# EAGLE schematic SPI_schematic (EAGLE 8.1.0)
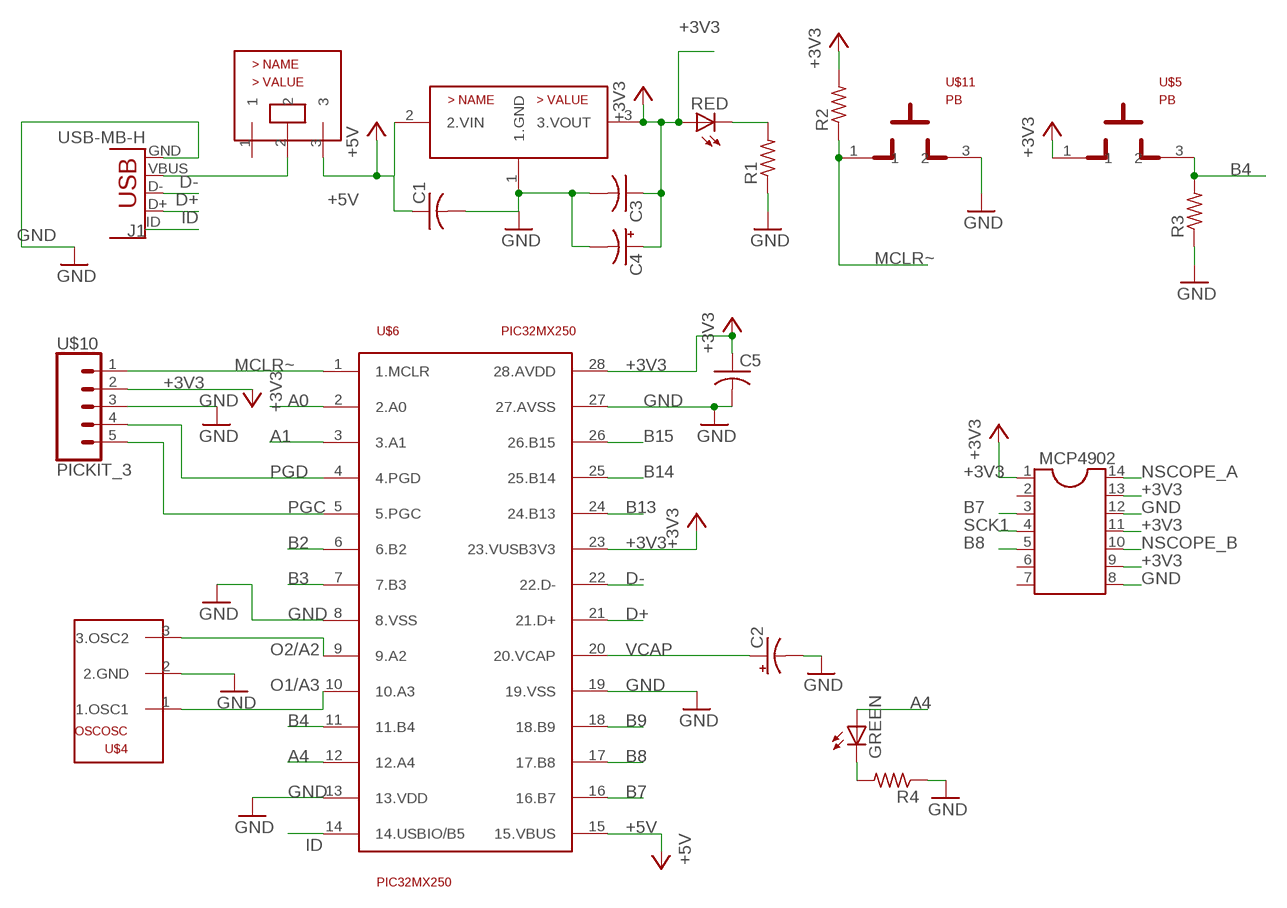
[diagram p0: schematic, sheet 1]

## Parts
_  MCP1702  [TO92]
C1  C-US025-025X050  [C025-025X050]
C2  CPOL-USB45181B  [B45181B]
C3  C-US025-025X050  [C025-025X050]
C4  CPOL-USB45181B  [B45181B]
C5  C-US025-025X050  [C025-025X050]
GREEN  LED3MM  [LED3MM]
J1  USB-MB-H  [USB-MB-H]
MCP4902  DIL14  [DIL14]
R1  R-US_0204/7  [0204/7]
R2  R-US_0204/7  [0204/7]
R3  R-US_0204/7  [0204/7]
R4  R-US_0204/7  [0204/7]
RED  LED3MM  [LED3MM]
U$4  OSCOSC  [OSC]
U$5  PB  [PB]
U$6  PIC32MX250  [DIL28-3]
U$8  SLIDE  [SLIDE]
U$10  PICKIT_3  [1X05]
U$11  PB  [PB]

## Nets
+3V3: _.3(3.VOUT) C3.1 C4.+ C5.1 MCP4902.1 MCP4902.9 MCP4902.11 MCP4902.13 R2.2 RED.A U$5.1 U$6.23(23.VUSB3V3) U$6.28(28.AVDD) U$10.2(2.VDD)
+5V: _.2(2.VIN) C1.1 U$6.15(15.VBUS) U$8.3
A0: U$6.2(2.A0)
A1: U$6.3(3.A1)
A4: GREEN.A U$6.12(12.A4)
B2: U$6.6(6.B2)
B3: U$6.7(7.B3)
B4: R3.2 U$5.3 U$6.11(11.B4)
B7: MCP4902.3 U$6.16(16.B7)
B8: MCP4902.5 U$6.17(17.B8)
B9: U$6.18(18.B9)
B13: U$6.24(24.B13)
B14: U$6.25(25.B14)
B15: U$6.26(26.B15)
D+: J1.D+ U$6.21(21.D+)
D-: J1.D- U$6.22(22.D-)
GND: _.1(1.GND) C1.2 C2.- C3.2 C4.- C5.2 J1.GND MCP4902.8 MCP4902.12 R1.1 R3.1 R4.1 U$4.2(2.GND) U$6.8(8.VSS) U$6.13(13.VDD) U$6.19(19.VSS) U$6.27(27.AVSS) U$10.3(3.VSS) U$11.3
ID: J1.ID U$6.14(14.USBIO/B5)
MCLR~: R2.1 U$6.1(1.MCLR) U$10.1(1.MCLR~) U$11.1
N$1: J1.VBUS U$8.2
N$18: R1.2 RED.K(C)
N$23: GREEN.K(C) R4.2
NSCOPE_A: MCP4902.14
NSCOPE_B: MCP4902.10
O1/A3: U$4.1(1.OSC1) U$6.10(10.A3)
O2/A2: U$4.3(3.OSC2) U$6.9(9.A2)
PGC: U$6.5(5.PGC) U$10.5(5.PGC)
PGD: U$6.4(4.PGD) U$10.4(4.PGD)
SCK1: MCP4902.4
VCAP: C2.+ U$6.20(20.VCAP)
Unconnected: MCP4902.2 MCP4902.6 MCP4902.7 U$8.1

## Library data of the parts
_ = ME433_Spring2017:MCP1702
C1 C3 C5 = ME433_Spring2017:C-US: CAPACITOR, American symbol
C2 C4 = ME433_Spring2017:CPOL-US: POLARIZED CAPACITOR, American symbol
GREEN RED = ME433_Spring2017:LED: LED OSRAM: - CHIPLED LG R971, LG N971, LY N971, LG Q971, LY Q971, LO R971, LY R971 LH N974, LH R974 LS Q976, LO Q976, LY Q976 LO Q996 - Hyper CHIPLED LW Q18S LB Q993, LB Q99A, LB R99A - SideLED LS A670, LO A670, LY A670, LG A670, LP A670 LB A673, LV A673, LT A673, LW A673 LH A674 LY A675 LS A676, LA A676, LO A676, LY A676, LW A676 LS A679, LY A679, LG A679 - Hyper Micro SIDELED® LS Y876, LA Y876, LO Y876, LY Y876 LT Y87S - SmartLED LW L88C, LW L88S LB L89C, LB L89S, LG L890 LS L89K, LO L89K, LY L89K LS L896, LA L896, LO L896, LY L896 - TOPLED LS T670, LO T670, LY T670, LG T670, LP T670 LSG T670, LSP T670, LSY T670, LOP T670, LYG T670 LG T671, LOG T671, LSG T671 LB T673, LV T673, LT T673, LW T673 LH T674 LS T676, LA T676, LO T676, LY T676, LB T676, LH T676, LSB T676, LW T676 LB T67C, LV T67C, LT T67C, LS T67K, LO T67K, LY T67K, LW E67C LS E67B, LA E67B, LO E67B, LY E67B, LB E67C, LV E67C, LT E67C LW T67C LS T679, LY T679, LG T679 LS T770, LO T770, LY T770, LG T770, LP T770 LB T773, LV T773, LT T773, LW T773 LH T774 LS E675, LA E675, LY E675, LS T675 LS T776, LA T776, LO T776, LY T776, LB T776 LHGB T686 LT T68C, LB T68C - Hyper Mini TOPLED® LB M676 - Mini TOPLED Santana® LG M470 LS M47K, LO M47K, LY M47K Source: http://www.osram.convergy.de LUXEON: - LUMILED® LXK2-PW12-R00, LXK2-PW12-S00, LXK2-PW14-U00, LXK2-PW14-V00 LXK2-PM12-R00, LXK2-PM12-S00, LXK2-PM14-U00 LXK2-PE12-Q00, LXK2-PE12-R00, LXK2-PE12-S00, LXK2-PE14-T00, LXK2-PE14-U00 LXK2-PB12-K00, LXK2-PB12-L00, LXK2-PB12-M00, LXK2-PB14-N00, LXK2-PB14-P00, LXK2-PB14-Q00 LXK2-PR12-L00, LXK2-PR12-M00, LXK2-PR14-Q00, LXK2-PR14-R00 LXK2-PD12-Q00, LXK2-PD12-R00, LXK2-PD12-S00 LXK2-PH12-R00, LXK2-PH12-S00 LXK2-PL12-P00, LXK2-PL12-Q00, LXK2-PL12-R00 Source: www.luxeon.com KINGBRIGHT: KA-3528ASYC Source: www.kingbright.com
J1 = ME433_Spring2017:USB: USB Connectors USB-B-PTH is fully proven SKU : PRT-00139/CONN-08278 USB-miniB is fully proven SKU : PRT-00587 USB-A-PCB is untested. USB-A-H is throughly reviewed, but untested. Spark Fun Electronics SKU : PRT-00437 USB-B-SMT is throughly reviewed, but untested. Needs silkscreen touching up. USB-A-S has not been used/tested USB-MB-H has not been used/tested USB-MICROB has been used. CONN-09505
MCP4902 = ME433_Spring2017:DIL14: Dual In Line / Socket
R1-R4 = ME433_Spring2017:R-US_: RESISTOR, American symbol
U$4 = ME433_Spring2017:OSC
U$5 U$11 = ME433_Spring2017:PB
U$6 = ME433_Spring2017:PIC32MX250
U$8 = ME433_Spring2017:SLIDE
U$10 = ME433_Spring2017:PICKIT_3